# EAGLE design GroupeK (EAGLE 9.6.2)
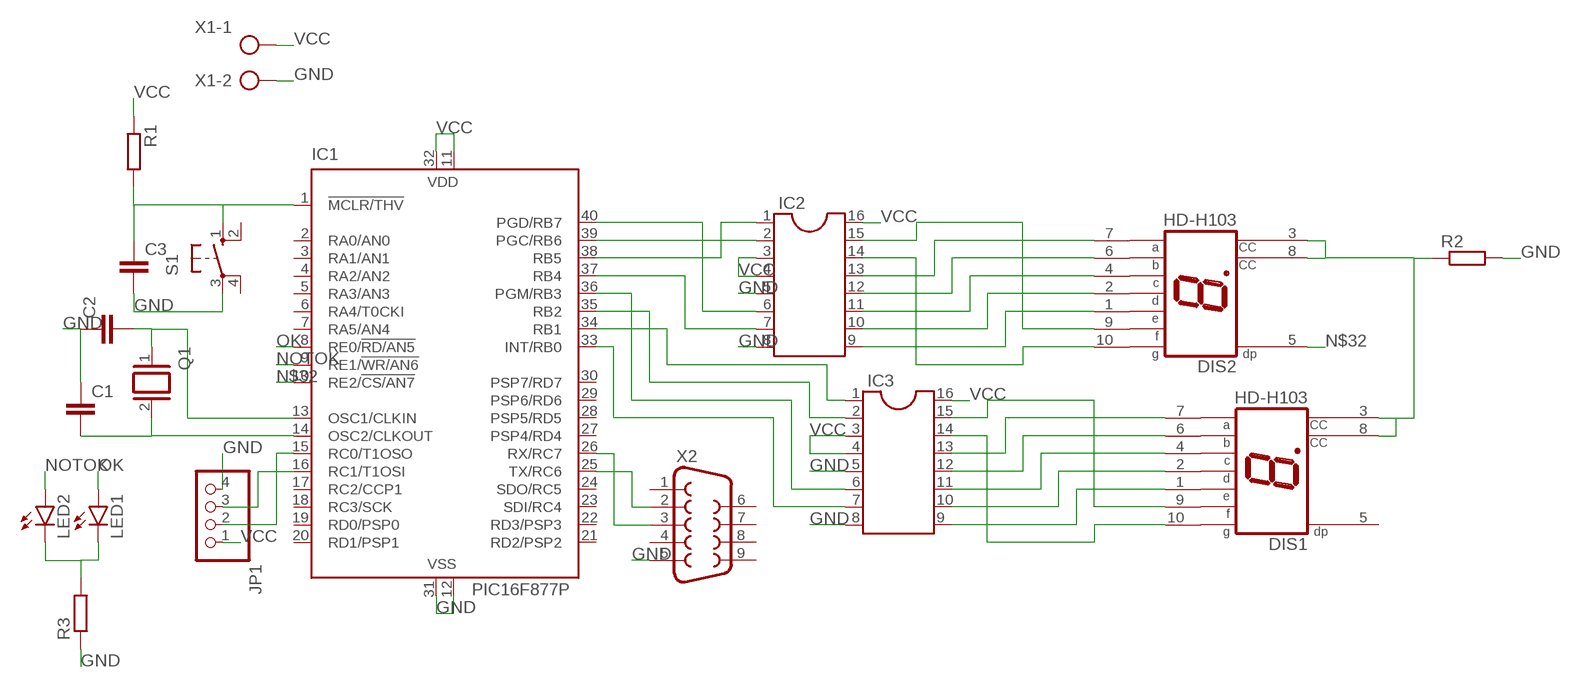
[diagram p0: schematic, sheet 1]

## Parts
C1  C-EU025-025X050  [C025-025X050]
C2  C-EU025-025X050  [C025-025X050]
C3  C-EU025-025X050  [C025-025X050]
DIS1  HD-H103  [HDSP-M]
DIS2  HD-H103  [HDSP-M]
IC1  PIC16F877P  [DIL40]
IC2  DIL16  [DIL16]
IC3  DIL16  [DIL16]
JP1  PINHD-1X4  [1X04]
LED1  LED5MM  [LED5MM]
LED2  LED5MM  [LED5MM]
Q1  XTAL/S  [QS]
R1  R-EU_0207/10  [0207/10]
R2  R-EU_0207/10  [0207/10]
R3  R-EU_0207/10  [0207/10]
S1  10-XX  [B3F-10XX]
X1  AK300/2  [AK300/2]
X2  F09H  [F09H]

## Nets
GND: C1.1 C2.1 C3.2 IC1.12(VSS) IC1.31(VSS) IC2.5 IC2.8 IC3.5 IC3.8 JP1.4 R2.2 R3.1 S1.3(P) X1.2 X2.5
N$1: DIS1.3(CC) DIS1.8(CC) DIS2.3(CC) DIS2.8(CC) R2.1
N$2: IC1.15(RC0/T1OSO) JP1.2
N$3: C3.1 IC1.1(!MCLR/THV) R1.2 S1.1(S)
N$4: C1.2 IC1.14(OSC2/CLKOUT) Q1.2
N$5: IC1.26(RX/RC7) X2.3
N$6: C2.2 IC1.13(OSC1/CLKIN) Q1.1
N$8: DIS2.7(A) IC2.13
N$9: IC1.39(PGC/RB6) IC2.2
N$10: IC1.40(PGD/RB7) IC2.6
N$11: DIS2.6(B) IC2.12
N$12: IC1.37(RB4) IC2.7
N$13: IC1.38(RB5) IC2.1
N$14: DIS2.4(C) IC2.11
N$15: DIS2.2(D) IC2.10
N$16: DIS2.1(E) IC2.9
N$17: DIS2.9(F) IC2.15
N$18: DIS2.10(G) IC2.14
N$19: LED1.K(C) LED2.K(C) R3.2
N$20: DIS1.7(A) IC3.13
N$21: DIS1.6(B) IC3.12
N$22: DIS1.4(C) IC3.11
N$23: DIS1.2(D) IC3.10
N$24: DIS1.1(E) IC3.9
N$25: DIS1.9(F) IC3.15
N$26: DIS1.10(G) IC3.14
N$27: IC1.25(TX/RC6) X2.2
N$28: IC1.34(RB1) IC3.1
N$29: IC1.35(RB2) IC3.2
N$30: IC1.36(PGM/RB3) IC3.6
N$31: IC1.33(INT/RB0) IC3.7
N$32: DIS2.5(DP) IC1.10(RE2/!CS/AN7)
N$33: IC1.16(RC1/T1OSI) JP1.3
NOTOK: IC1.9(RE1/!WR/AN6) LED2.A
OK: IC1.8(RE0/!RD/AN5) LED1.A
VCC: IC1.11(VDD) IC1.32(VDD) IC2.3 IC2.4 IC2.16 IC3.3 IC3.4 IC3.16 JP1.1 R1.1 X1.1
Unconnected: DIS1.5(DP) IC1.2(RA0/AN0) IC1.3(RA1/AN1) IC1.4(RA2/AN2) IC1.5(RA3/AN3) IC1.6(RA4/T0CKI) IC1.7(RA5/AN4) IC1.17(RC2/CCP1) IC1.18(RC3/SCK) IC1.19(RD0/PSP0) IC1.20(RD1/PSP1) IC1.21(RD2/PSP2) IC1.22(RD3/PSP3) IC1.23(SDI/RC4) IC1.24(SDO/RC5) IC1.27(PSP4/RD4) IC1.28(PSP5/RD5) IC1.29(PSP6/RD6) IC1.30(PSP7/RD7) S1.2(S1) S1.4(P1) X2.1 X2.4 X2.6 X2.7 X2.8 X2.9

## Library data of the parts
C1-C3 = rcl:C-EU: CAPACITOR, European symbol; SPICEPREFIX: C
DIS1 DIS2 = display-hp:HD-H103: LED DISPLAY 1-character 7 segment, decimal point right; OC_FARNELL: unknown; OC_NEWARK: unknown
IC1 = microchip:PIC16F87*: MICROCONTROLLER; MF: MICROCHIP; MPN: PIC16F877-04/P; OC_FARNELL: 9761349; OC_NEWARK: 61K3463
IC2 IC3 = ic-package:DIL16: Dual In Line / Socket
JP1 = pinhead:PINHD-1X4: PIN HEADER
LED1 LED2 = led:LED: LED OSRAM: - CHIPLED LG R971, LG N971, LY N971, LG Q971, LY Q971, LO R971, LY R971 LH N974, LH R974 LS Q976, LO Q976, LY Q976 LO Q996 - Hyper CHIPLED LW Q18S LB Q993, LB Q99A, LB R99A - SideLED LS A670, LO A670, LY A670, LG A670, LP A670 LB A673, LV A673, LT A673, LW A673 LH A674 LY A675 LS A676, LA A676, LO A676, LY A676, LW A676 LS A679, LY A679, LG A679 - Hyper Micro SIDELED® LS Y876, LA Y876, LO Y876, LY Y876 LT Y87S - SmartLED LW L88C, LW L88S LB L89C, LB L89S, LG L890 LS L89K, LO L89K, LY L89K LS L896, LA L896, LO L896, LY L896 - TOPLED LS T670, LO T670, LY T670, LG T670, LP T670 LSG T670, LSP T670, LSY T670, LOP T670, LYG T670 LG T671, LOG T671, LSG T671 LB T673, LV T673, LT T673, LW T673 LH T674 LS T676, LA T676, LO T676, LY T676, LB T676, LH T676, LSB T676, LW T676 LB T67C, LV T67C, LT T67C, LS T67K, LO T67K, LY T67K, LW E67C LS E67B, LA E67B, LO E67B, LY E67B, LB E67C, LV E67C, LT E67C LW T67C LS T679, LY T679, LG T679 LS T770, LO T770, LY T770, LG T770, LP T770 LB T773, LV T773, LT T773, LW T773 LH T774 LS E675, LA E675, LY E675, LS T675 LS T776, LA T776, LO T776, LY T776, LB T776 LHGB T686 LT T68C, LB T68C - Hyper Mini TOPLED® LB M676 - Mini TOPLED Santana® LG M470 LS M47K, LO M47K, LY M47K Source: http://www.osram.convergy.de LUXEON: - LUMILED® LXK2-PW12-R00, LXK2-PW12-S00, LXK2-PW14-U00, LXK2-PW14-V00 LXK2-PM12-R00, LXK2-PM12-S00, LXK2-PM14-U00 LXK2-PE12-Q00, LXK2-PE12-R00, LXK2-PE12-S00, LXK2-PE14-T00, LXK2-PE14-U00 LXK2-PB12-K00, LXK2-PB12-L00, LXK2-PB12-M00, LXK2-PB14-N00, LXK2-PB14-P00, LXK2-PB14-Q00 LXK2-PR12-L00, LXK2-PR12-M00, LXK2-PR14-Q00, LXK2-PR14-R00 LXK2-PD12-Q00, LXK2-PD12-R00, LXK2-PD12-S00 LXK2-PH12-R00, LXK2-PH12-S00 LXK2-PL12-P00, LXK2-PL12-Q00, LXK2-PL12-R00 Source: www.luxeon.com KINGBRIGHT: KA-3528ASYC Source: www.kingbright.com
Q1 = special:XTAL/S: CRYSTAL
R1-R3 = rcl:R-EU_: RESISTOR, European symbol; SPICEPREFIX: R
S1 = switch-omron:10-XX: OMRON SWITCH; MPN: B3F-1000; OC_FARNELL: 176432; OC_NEWARK: 36M3542
X1 = con-ptr500:AK300/2: CONNECTOR; OC_FARNELL: unknown; OC_NEWARK: unknown
X2 = con-subd:F09: SUB-D; OC_FARNELL: unknown; OC_NEWARK: unknown

## Board
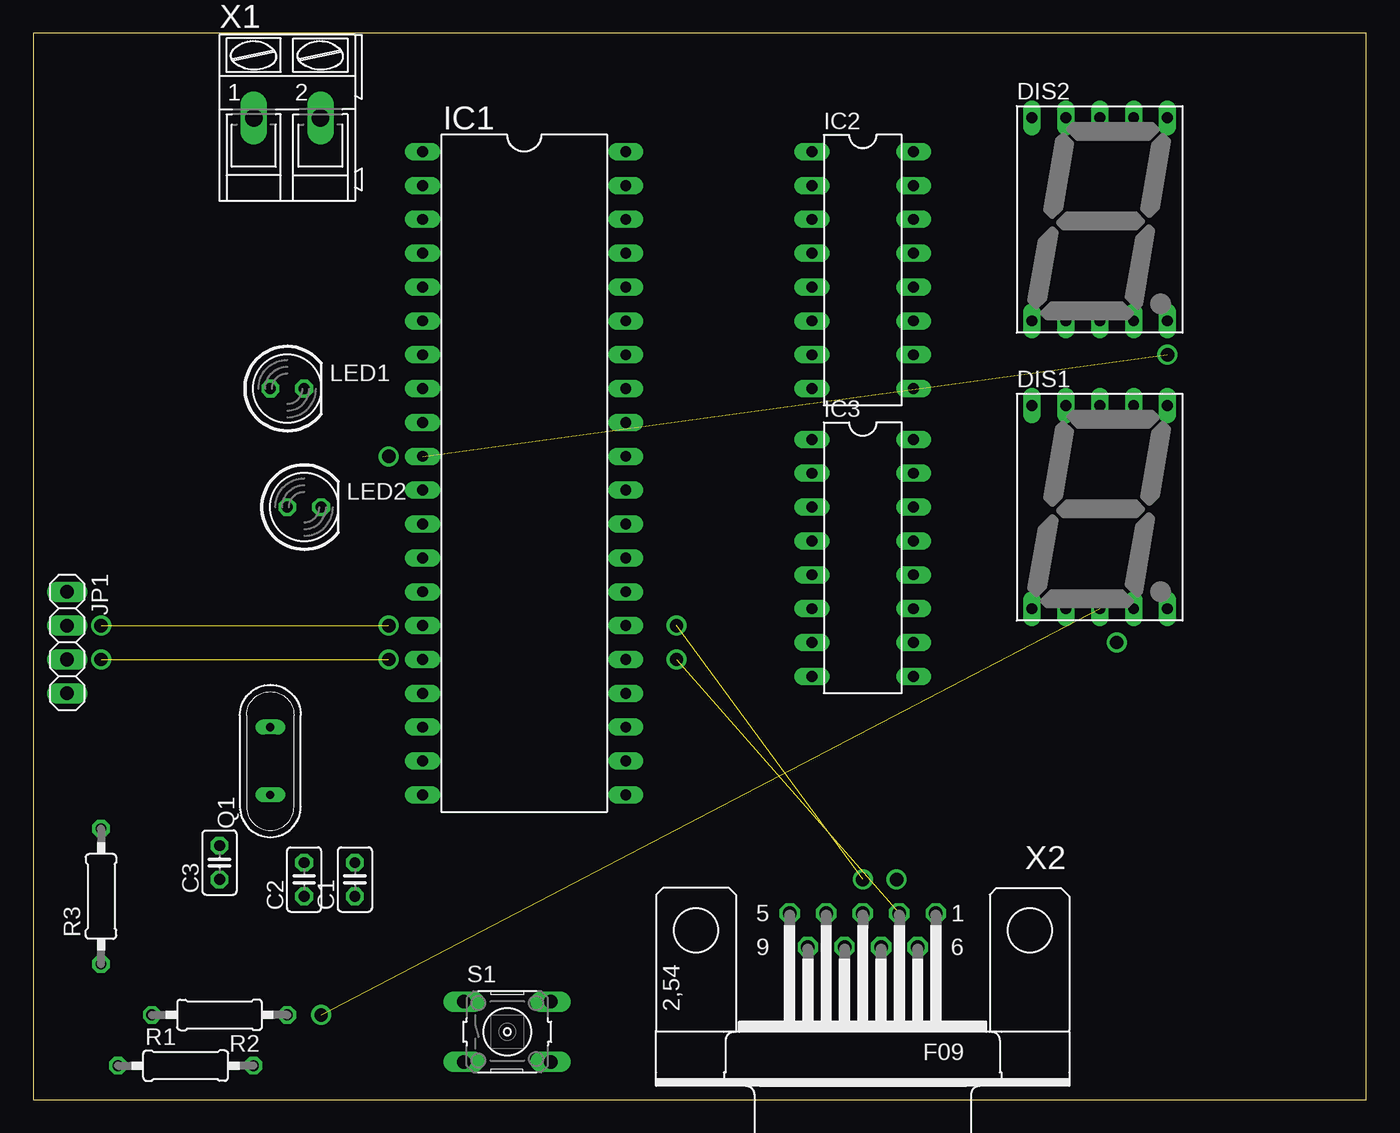
[diagram p1: board, top side]
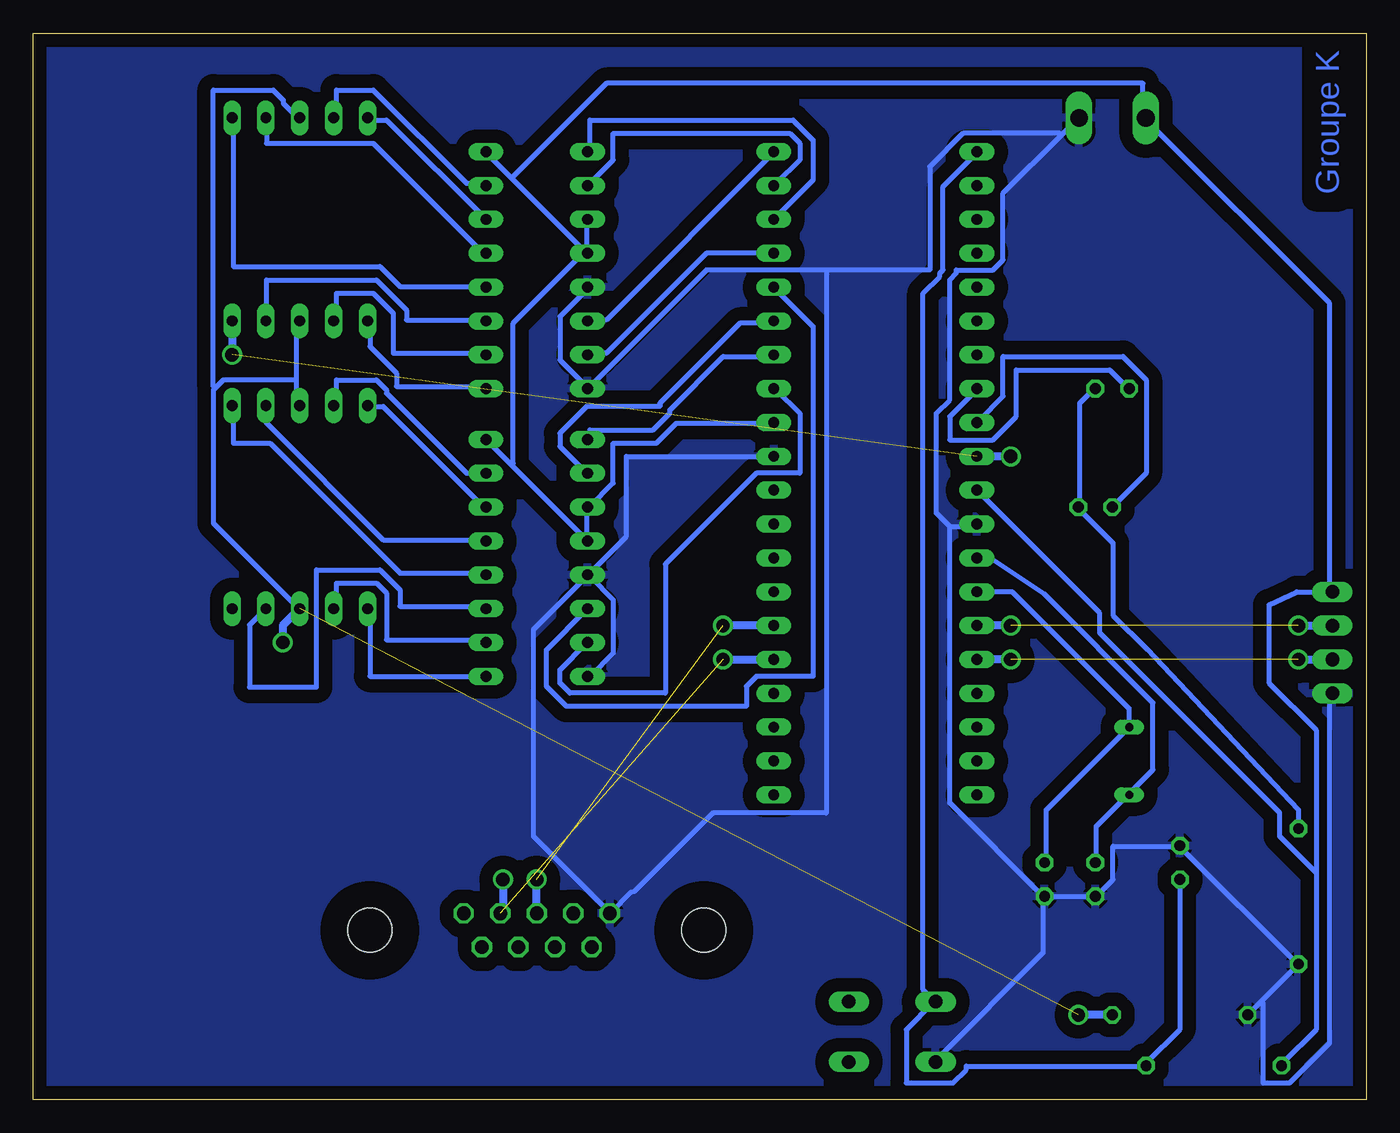
[diagram p2: board, bottom side, seen from below]

Size 100 x 80 mm. Coordinates in mm from the lower left corner, seen from the top.
Outline: 0,0 100,0 100,80 0,80 0,0
Copper layers (1*16): Top 0.035mm / dielectric 1.5mm / Bottom 0.035mm
Design rules "default *": minimum track width 15mil, minimum drill 0.35mm, track to track 15mil, track to pad 15mil, pad to pad 15mil, via to via 15mil, smd to smd 15mil, copper to edge 40mil, drill to drill 6mil, minimum pad ring 10mil, minimum via ring 8mil, stop-mask expansion 4mil, vias tented up to drill 0mil, thermal gap 10mil

### Footprints (pad centres in the part's own frame; a part is rotated, then mirrored left to right if it is on the bottom)
C025-025X050 = drill 0.813 octagon: 1 -1.27,0; 2 1.27,0
HDSP-M = drill 0.813 long: 1 -5.08,-7.62; 2 -2.54,-7.62; 3 0,-7.62; 4 2.54,-7.62; 5 5.08,-7.62; 6 5.08,7.62; 7 2.54,7.62; 8 0,7.62; 9 -2.54,7.62; 10 -5.08,7.62
DIL40 = drill 0.813 long: 1 -24.13,-7.62; 2 -21.59,-7.62; 3 -19.05,-7.62; 4 -16.51,-7.62; 5 -13.97,-7.62; 6 -11.43,-7.62; 7 -8.89,-7.62; 8 -6.35,-7.62; 9 -3.81,-7.62; 10 -1.27,-7.62; 11 1.27,-7.62; 12 3.81,-7.62; 13 6.35,-7.62; 14 8.89,-7.62; 15 11.43,-7.62; 16 13.97,-7.62; 17 16.51,-7.62; 18 19.05,-7.62; 19 21.59,-7.62; 20 24.13,-7.62; 21 24.13,7.62; 22 21.59,7.62; 23 19.05,7.62; 24 16.51,7.62; 25 13.97,7.62; 26 11.43,7.62; 27 8.89,7.62; 28 6.35,7.62; 29 3.81,7.62; 30 1.27,7.62; 31 -1.27,7.62; 32 -3.81,7.62; 33 -6.35,7.62; 34 -8.89,7.62; 35 -11.43,7.62; 36 -13.97,7.62; 37 -16.51,7.62; 38 -19.05,7.62; 39 -21.59,7.62; 40 -24.13,7.62
DIL16 = drill 0.813 long: 1 -8.89,-3.81; 2 -6.35,-3.81; 3 -3.81,-3.81; 4 -1.27,-3.81; 5 1.27,-3.81; 6 3.81,-3.81; 7 6.35,-3.81; 8 8.89,-3.81; 9 8.89,3.81; 10 6.35,3.81; 11 3.81,3.81; 12 1.27,3.81; 13 -1.27,3.81; 14 -3.81,3.81; 15 -6.35,3.81; 16 -8.89,3.81
1X04 = drill 1.016 long: 1 -3.81,0; 2 -1.27,0; 3 1.27,0; 4 3.81,0
LED5MM = drill 0.813 octagon: A -1.27,0; K 1.27,0
QS = drill 0.61 long: 1 -2.54,0; 2 2.54,0
0207/10 = drill 0.813 octagon: 1 -5.08,0; 2 5.08,0
B3F-10XX = drill 1.016 long: 1 -3.251,2.261; 2 3.251,2.261; 3 -3.251,-2.261; 4 3.251,-2.261
AK300/2 = drill 1.321 long: 1 -2.515,0; 2 2.489,0
F09H = drill 1.016 octagon: 1 -5.486,-1.27; 2 -2.743,-1.27; 3 0,-1.27; 4 2.743,-1.27; 5 5.486,-1.27; 6 -4.115,1.27; 7 -1.372,1.27; 8 1.372,1.27; 9 4.115,1.27 | hole 3.302: -12.522,0; 12.522,0

### Placement (x,y rotation side)
C1  24.13,16.51 90 top
C2  20.32,16.51 90 top
C3  13.97,17.78 90 top
DIS1  80.01,44.45 0 top
DIS2  80.01,66.04 0 top
IC1  36.83,46.99 270 top
IC2  62.23,62.23 270 top
IC3  62.23,40.64 270 top
JP1  2.54,34.29 270 top
LED1  19.05,53.34 0 top
LED2  20.32,44.45 0 top
Q1  17.78,25.4 90 top
R1  11.43,2.54 0 top
R2  13.97,6.35 180 top
R3  5.08,15.24 90 top
S1  35.56,5.08 0 top
X1  19.05,73.66 0 top
X2  62.23,12.7 180 top

### Tracks (layer width: path | path; a pad name or v marks a point on that pad's centre or on a via)
GND
  Bottom 0.381: IC3.8 58.25,31.75 56.5,33.5 56.5,37.5 58.25,39.25 IC3.5 | IC1.31 44.5,48.25 55.5,48.25 55.5,42.25 58.25,39.5 IC3.5 | IC3.5 58.5,39.25 62.5,35.25 62.5,19.77 56.74,14.01 X2.5 55.15,15.57 54.9,15.62 49.02,21.5 40.5,21.5 40.5,62.25 | 7.88,7.38 8.75,6.5 R2.2 | 7.88,7.38 5.25,10 R3.1 5.25,10.25 13.75,18.75 13.75,19 C3.2 14,19 19,19 19,16.5 20.25,15.25 C2.1 20.5,15.25 24,15.25 C1.1 | JP1.4 2.75,30.25 2.75,4.25 5.75,1.25 7.75,1.25 7.75,7.25 7.88,7.38 | IC2.5 58.5,60.75 60.5,58.75 60.5,55.5 58.5,53.5 IC2.8 58.25,53.5 49.5,62.25 40.5,62.25 | 31.25,43 29.25,43 IC1.12 | 31.25,43 31.25,22.25 24.25,15.25 C1.1 | S1.3 32.25,3 24.25,11 24.25,15 C1.1 | 22.88,72.38 27.25,68 27.25,63 28,62.25 30.75,62.25 30.75,62 31.25,61.5 31.25,52.5 32.25,51.5 32.25,44 31.25,43 | 22.88,72.38 21.75,73.5 X1.2 | 40.5,62.25 32.75,62.25 32.75,70 30.25,72.5 23,72.5 22.88,72.38
  pour Bottom (isolate 1.016): 0,80.01 100.33,80.01 100.33,0 0,0
N$1  (via drill 1 pad 1.3)  (1 unrouted)
  Bottom 0.381: 86.38,53.38 85.75,54 80.25,54 | 86.38,53.38 86.5,53.25 86.5,43.25 80.25,37 DIS1.3 | 80.25,54 80.25,52.25 DIS1.8 | 80.25,54 80.25,58.25 DIS2.3 | DIS2.8 80.25,73.75 81.25,74.75 81.25,75 82,75.75 86.5,75.75 86.5,53.5 86.38,53.38
  Bottom 0.61: R2.1 v21.59,6.35 | v81.28,34.29 81.28,35.56 DIS1.3
N$2  (via drill 1 pad 1.3)  (1 unrouted)
  Bottom 0.61: v5.08,35.56 JP1.2 | v26.67,35.56 IC1.15
N$3
  Bottom 0.381: C3.1 14,16.5 14,5.25 16.5,2.75 R1.2 16.75,2.5 30,2.5 30,2.25 31,1.25 34.5,1.25 34.5,5.25 32.5,7.25 S1.1 32.5,7.5 33.25,8.25 33.25,60.5 32,61.75 32,62 31.75,62.25 31.75,68.5 29.25,71 IC1.1
N$4
  Bottom 0.381: C1.2 24,18 24,21.75 18,27.75 Q1.2 17.78,29.32 26.56,38.1 IC1.14
N$5  (via drill 1 pad 1.3)  (1 unrouted)
  Bottom 0.61: X2.3 v62.23,16.51 | IC1.26 v48.26,35.56
N$6
  Bottom 0.381: C2.2 20.25,18 20.25,20.5 18,22.75 Q1.1 17.75,23 16,24.75 16,29.77 24.19,37.96 28.21,40.64 IC1.13
N$8
  Bottom 0.381: IC2.13 66.25,63.5 74.5,71.75 82.5,71.75 82.5,73.5 DIS2.7
N$9
  Bottom 0.381: IC2.2 56.5,70.5 56.5,72.5 43.25,72.5 42.5,71.75 42.5,70.5 44.25,68.75 IC1.39
N$10
  Bottom 0.381: IC2.6 58.25,58.5 57,58.5 44.5,71 IC1.40
N$11
  Bottom 0.381: IC2.12 66.25,61 72.5,61 74,62.5 85,62.5 85,73.5 DIS2.6
N$12
  Bottom 0.381: IC1.37 49.5,63.5 57,56 58.25,56 IC2.7
N$13
  Bottom 0.381: IC1.38 44.25,66.25 41.5,69 41.5,72 43,73.5 58.25,73.5 58.25,71.25 IC2.1
N$14
  Bottom 0.381: IC2.11 66.25,58.5 72,58.5 72,59.25 74.25,61.5 82.5,61.5 82.5,58.5 DIS2.4
N$15
  Bottom 0.381: IC2.10 66.25,56 73,56 73,59 74.5,60.5 77.25,60.5 77.25,58.5 DIS2.2
N$16
  Bottom 0.381: IC2.9 66.25,53.5 72.75,53.5 72.75,54.5 74.75,56.5 74.75,58.25 DIS2.1
N$17
  Bottom 0.381: IC2.15 66.25,68.75 67.5,68.75 74.5,75.75 77.25,75.75 77.25,73.75 DIS2.9
N$18
  Bottom 0.381: IC2.14 73.5,73.5 74.75,73.5 DIS2.10
N$19
  Bottom 0.381: R3.2 5.08,21.74 16.46,33.79 19,36.33 19,41.75 21.5,44.25 LED2.K 21.5,44.5 21.5,52.25 20.5,53.25 LED1.K
N$20
  Bottom 0.381: IC3.13 66.25,42 73.75,42 82.5,50.75 82.5,52 DIS1.7
N$21
  Bottom 0.381: IC3.12 66.25,39.5 72.5,39.5 82.25,49.25 85,49.25 85,52 DIS1.6
N$22
  Bottom 0.381: DIS1.4 83.77,35.61 83.77,30.94 78.75,30.94 78.75,39.75 74,39.75 72.5,38.25 72.5,37 66.25,37 IC3.11
N$23
  Bottom 0.381: IC3.10 66.25,34.5 73.5,34.5 73.5,38 74.25,38.75 77.25,38.75 77.25,37 DIS1.2
N$24
  Bottom 0.381: IC3.9 74.75,31.75 74.75,36.75 DIS1.1
N$25
  Bottom 0.381: IC3.15 66.25,47 67.5,47 73.5,53 73.5,53.25 74.25,54 77.25,54 77.25,52.25 DIS1.9
N$26
  Bottom 0.381: IC3.14 66.25,44.5 73.75,52 74.75,52 DIS1.10
N$27  (via drill 1 pad 1.3)  (1 unrouted)
  Bottom 0.61: v48.26,33.02 IC1.25
N$28
  Bottom 0.381: IC1.34 44.5,55.75 48.25,55.75 52.25,51.75 52.25,51.5 53.5,50.25 58.25,50.25 58.25,49.75 IC3.1
N$29
  Bottom 0.381: IC3.2 58.5,47 60.5,49 60.5,50 58.5,52 53,52 53,52.25 47,58.25 44.5,58.25 IC1.35
N$30
  Bottom 0.381: IC3.6 61.5,33.75 61.5,31 60,29.5 46.5,29.5 46.5,31 45.75,31.75 41.5,31.75 41.5,58 44.25,60.75 IC1.36
N$31
  Bottom 0.381: IC3.7 58.5,34.25 60.5,32.25 60.5,31.25 59.75,30.5 52.58,30.5 52.58,40.17 45.75,47 42.5,47 42.5,51.5 44.25,53.25 IC1.33
N$32  (via drill 1 pad 1.3)  (1 unrouted)
  Bottom 0.61: DIS2.5 v85.09,55.88 | v26.67,48.26 IC1.10
N$33  (via drill 1 pad 1.3)  (1 unrouted)
  Bottom 0.61: v26.67,33.02 IC1.16 | v5.08,33.02 JP1.3
N$34  (via drill 1 pad 1.3)
  Bottom 0.61: v64.77,16.51 64.77,13.97
NOTOK
  Bottom 0.381: LED2.A 16.5,47 16.5,54 18.25,55.75 27.25,55.75 27.25,52.75 29,51 IC1.9
OK
  Bottom 0.381: LED1.A 18,53.5 19.25,54.75 26.25,54.75 26.25,51.25 28,49.5 31.25,49.5 31.25,51.25 29.25,53.25 IC1.8
VCC
  Bottom 0.381: 58.5,63.5 58.5,66 IC2.3 | 58.5,63.5 64.12,69.12 | 64.12,69.12 66,71 IC2.16 | 58.5,63.5 IC2.4 58.75,63.5 64,58.25 64,47.75 64.12,47.62 | 58.5,42 58.5,44.25 IC3.3 58.25,44.5 56.5,46.25 56.5,49.25 53.25,49.25 51.75,50.75 44.5,50.75 IC1.32 | 58.5,42 64.12,47.62 | 64.12,47.62 66,49.5 IC3.16 | 58.5,42 IC3.4 | 3.75,17 3.75,27.73 7.29,31.27 7.29,37.11 5.21,38.1 JP1.1 2.75,38.25 2.75,59.75 16.5,73.5 X1.1 16.75,73.75 16.75,76.25 57,76.25 64.12,69.12 | 3.75,17 3.75,5.25 6.25,2.75 R1.1 | 3.75,17 6.5,19.75 6.5,21.52 20,35.02 20,36.5 29,45.5 IC1.11

### Text on the board
Bottom: Groupe K